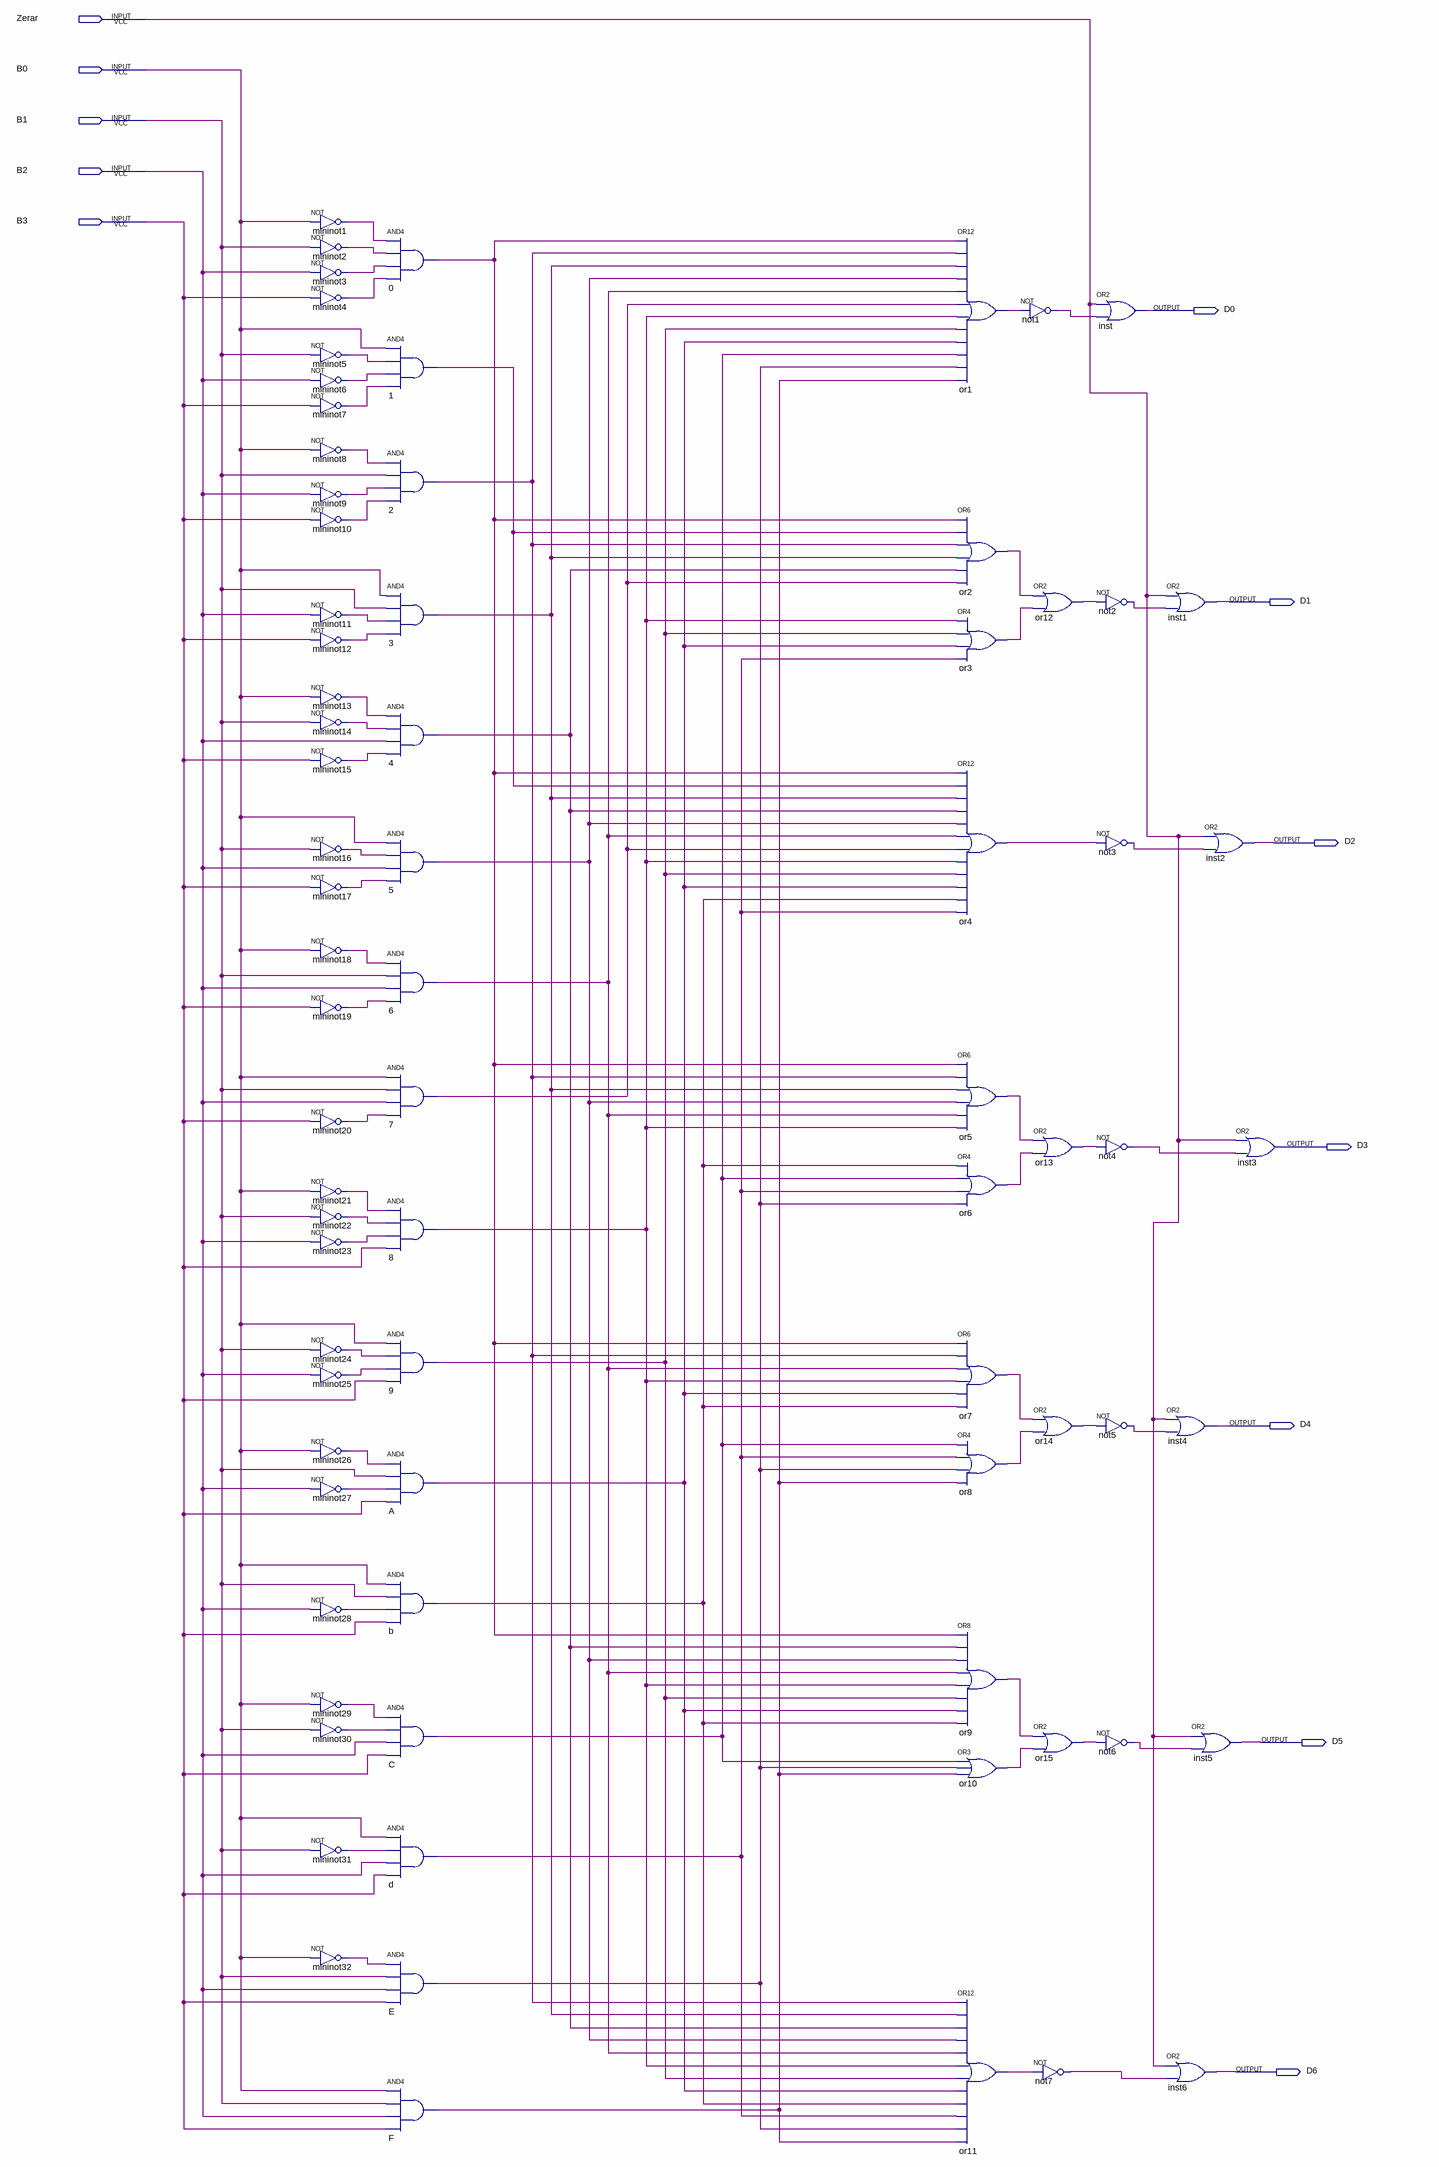
[diagram p0: schematic sheet]
// Quartus schematic aula4.bdf as structural Verilog: 77 symbols, 12 pins
module aula4 (
  input  Zerar,
  input  B0,
  input  B1,
  input  B2,
  input  B3,
  output D0,
  output D1,
  output D2,
  output D3,
  output D4,
  output D5,
  output D6
);

  wire A_out, b_out, C_out, d_out, E_out, F_out, mininot1_out, mininot2_out, mininot3_out, mininot4_out,
       mininot5_out, mininot6_out, mininot7_out, mininot8_out, mininot9_out, mininot10_out, mininot11_out,
       mininot12_out, mininot13_out, mininot14_out, mininot15_out, mininot16_out, mininot17_out,
       mininot18_out, mininot19_out, mininot20_out, mininot21_out, mininot22_out, mininot23_out,
       mininot24_out, mininot25_out, mininot26_out, mininot27_out, mininot28_out, mininot29_out,
       mininot30_out, mininot31_out, mininot32_out, n0_out, n1_out, n2_out, n3_out, n4_out, n5_out, n6_out,
       n7_out, n8_out, n9_out, not1_out, not2_out, not3_out, not4_out, not5_out, not6_out, not7_out, or1_out,
       or2_out, or3_out, or4_out, or5_out, or6_out, or7_out, or8_out, or9_out, or10_out, or11_out, or12_out,
       or13_out, or14_out, or15_out;

  not mininot1 (mininot1_out, B0);
  not mininot2 (mininot2_out, B1);
  not mininot3 (mininot3_out, B2);
  not mininot4 (mininot4_out, B3);
  not mininot5 (mininot5_out, B1);
  not mininot6 (mininot6_out, B2);
  not mininot7 (mininot7_out, B3);
  not mininot8 (mininot8_out, B0);
  not mininot9 (mininot9_out, B2);
  not mininot10 (mininot10_out, B3);
  not mininot11 (mininot11_out, B2);
  not mininot12 (mininot12_out, B3);
  not mininot13 (mininot13_out, B0);
  not mininot14 (mininot14_out, B1);
  not mininot15 (mininot15_out, B3);
  not mininot16 (mininot16_out, B1);
  not mininot17 (mininot17_out, B3);
  not mininot18 (mininot18_out, B0);
  not mininot19 (mininot19_out, B3);
  not mininot20 (mininot20_out, B3);
  not mininot21 (mininot21_out, B0);
  not mininot22 (mininot22_out, B1);
  not mininot23 (mininot23_out, B2);
  not mininot24 (mininot24_out, B1);
  not mininot25 (mininot25_out, B2);
  not mininot26 (mininot26_out, B0);
  not mininot27 (mininot27_out, B2);
  not mininot28 (mininot28_out, B2);
  not mininot29 (mininot29_out, B0);
  not mininot30 (mininot30_out, B1);
  not mininot31 (mininot31_out, B1);
  not mininot32 (mininot32_out, B0);
  and u_0 (n0_out, mininot1_out, mininot2_out, mininot3_out, mininot4_out);
  and u_1 (n1_out, B0, mininot5_out, mininot6_out, mininot7_out);
  and u_2 (n2_out, mininot8_out, B1, mininot9_out, mininot10_out);
  and u_3 (n3_out, B0, B1, mininot11_out, mininot12_out);
  and u_4 (n4_out, mininot13_out, mininot14_out, B2, mininot15_out);
  and u_5 (n5_out, B0, mininot16_out, B2, mininot17_out);
  and u_6 (n6_out, mininot18_out, B1, B2, mininot19_out);
  and u_7 (n7_out, B0, B1, B2, mininot20_out);
  and u_8 (n8_out, mininot21_out, mininot22_out, mininot23_out, B3);
  and u_9 (n9_out, B0, mininot24_out, mininot25_out, B3);
  and A (A_out, mininot26_out, B1, mininot27_out, B3);
  and b (b_out, B0, B1, mininot28_out, B3);
  and C (C_out, mininot29_out, mininot30_out, B2, B3);
  and d (d_out, B0, mininot31_out, B2, B3);
  and E (E_out, mininot32_out, B1, B2, B3);
  and F (F_out, B0, B1, B2, B3);
  or or1 (or1_out, n0_out, n2_out, n3_out, n5_out, n6_out, n7_out, n8_out, n9_out, A_out, C_out, E_out, F_out);
  or or2 (or2_out, n0_out, n1_out, n2_out, n3_out, n4_out, n7_out);
  or or3 (or3_out, n8_out, n9_out, A_out, d_out);
  or or4 (or4_out, n0_out, n1_out, n3_out, n4_out, n5_out, n6_out, n7_out, n8_out, n9_out, A_out, b_out, d_out);
  or or5 (or5_out, n0_out, n2_out, n3_out, n5_out, n6_out, n8_out);
  or or6 (or6_out, b_out, C_out, d_out, E_out);
  or or7 (or7_out, n0_out, n2_out, n6_out, n8_out, A_out, b_out);
  or or8 (or8_out, C_out, d_out, E_out, F_out);
  or or9 (or9_out, n0_out, n4_out, n5_out, n6_out, n8_out, n9_out, A_out, b_out);
  or or10 (or10_out, C_out, E_out, F_out);
  or or11 (or11_out, n2_out, n3_out, n4_out, n5_out, n6_out, n8_out, n9_out, A_out, b_out, d_out, E_out, F_out);
  not not1 (not1_out, or1_out);
  or or12 (or12_out, or2_out, or3_out);
  or or13 (or13_out, or5_out, or6_out);
  or or14 (or14_out, or7_out, or8_out);
  or or15 (or15_out, or9_out, or10_out);
  not not7 (not7_out, or11_out);
  or inst (D0, Zerar, not1_out);
  not not2 (not2_out, or12_out);
  not not3 (not3_out, or4_out);
  not not4 (not4_out, or13_out);
  not not5 (not5_out, or14_out);
  not not6 (not6_out, or15_out);
  or inst1 (D1, Zerar, not2_out);
  or inst4 (D4, Zerar, not5_out);
  or inst6 (D6, Zerar, not7_out);
  or inst2 (D2, Zerar, not3_out);
  or inst5 (D5, Zerar, not6_out);
  or inst3 (D3, Zerar, not4_out);
endmodule
